# Altium schematic sheet Sheet_1_2021-12-20.schdoc
size 54 x 37 mm
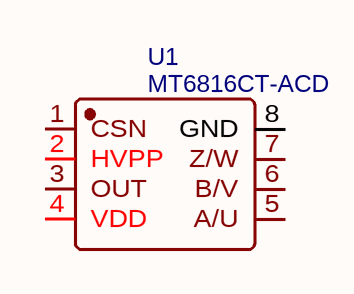
[diagram p0: Sheet_1_2021-12-20.schdoc]

## Parts
U1  MT6816CT-ACD  [SOP-8_L5.0-W4.0-P1.27-LS6.0-BL]

## Nets

Not connected (* = marked no-connect by the designer): U1 1(CSN) 2(HVPP) 3(OUT) 4(VDD) 5(A/U) 6(B/V) 7(Z/W) 8(GND)

## Library data of the parts
U1 = MT6816CT-ACD: BOM_Manufacturer: Magn Tek; Contributor: LCSC; BOM_Supplier: LCSC; BOM_Supplier Part: C879560; BOM_Manufacturer Part: MT6816CT-ACD; BOM_JLCPCB Part Class: Extended Part; spicePre: U; spiceSymbolName: MT6816CT-ACD